# EAGLE design ATZB-RF-233-1-C-RPI-Breakout (EAGLE 7.7.0)
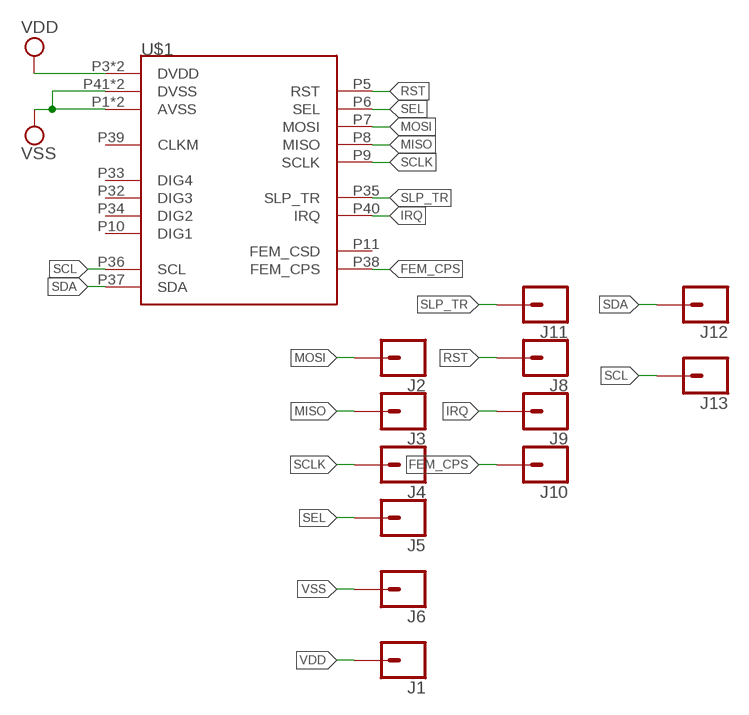
[diagram p0: schematic, sheet 1]

## Parts
J1  CONN_01OFFSET  [1X01_OFFSET]
J2  CONN_01OFFSET  [1X01_OFFSET]
J3  CONN_01OFFSET  [1X01_OFFSET]
J4  CONN_01OFFSET  [1X01_OFFSET]
J5  CONN_01OFFSET  [1X01_OFFSET]
J6  CONN_01OFFSET  [1X01_OFFSET]
J8  CONN_01OFFSET  [1X01_OFFSET]
J9  CONN_01OFFSET  [1X01_OFFSET]
J10  CONN_01OFFSET  [1X01_OFFSET]
J11  CONN_01OFFSET  [1X01_OFFSET]
J12  CONN_01OFFSET  [1X01_OFFSET]
J13  CONN_01OFFSET  [1X01_OFFSET]
U$1  ATZB-RF-233-1-C  [ATZB-RF-233-1-C]

## Nets
FEM_CPS: J10.1 U$1.P38(FEM_CPS)
IRQ: J9.1 U$1.P40(IRQ)
MISO: J3.1 U$1.P8(MISO)
MOSI: J2.1 U$1.P7(MOSI)
RST: J8.1 U$1.P5(RST)
SCL: J13.1 U$1.P36(SCL)
SCLK: J4.1 U$1.P9(SCLK)
SDA: J12.1 U$1.P37(SDA)
SEL: J5.1 U$1.P6(SEL)
SLP_TR: J11.1 U$1.P35(SLP_TR)
VDD: J1.1 U$1.P3(DVDD) U$1.P4(DVDD)
VSS: J6.1 U$1.P1(AVSS) U$1.P2(AVSS) U$1.P41(DVSS) U$1.P42(DVSS)
Unconnected: U$1.P10(DIG1) U$1.P11(FEM_CSD) U$1.P32(DIG3) U$1.P33(DIG4) U$1.P34(DIG2) U$1.P39(CLKM)

## Library data of the parts
J1-J6 J8-J13 = SparkFun-Connectors:CONN_01: Single connection point. Often used as Generic Header-pin footprint for 0.1 inch spaced/style header connections On any of the 0.1 inch spaced packages, you can populate with these: Break Away Headers - Straight <https://www.sparkfun.com/products/116> (PRT-00116) Break Away Male Headers - Right Angle <https://www.sparkfun.com/products/553> (PRT-00553) Female Headers <https://www.sparkfun.com/products/115> (PRT-00115) Break Away Headers - Machine Pin <https://www.sparkfun.com/products/117> (PRT-00117) Break Away Female Headers - Swiss Machine Pin <https://www.sparkfun.com/products/743> (PRT-00743) This device is also useful as a general connection point to wire up your design to another part of your project. Our various solder wires solder well into these plated through hole pads. Hook-Up Wire - Assortment (Stranded, 22 AWG) <https://www.sparkfun.com/products/11375> (PRT-11375) Hook-Up Wire - Assortment (Solid Core, 22 AWG) <https://www.sparkfun.com/products/11367> (PRT-11367) View the entire wire category on our website here <https://www.sparkfun.com/categories/141> Special notes: SMTSO-256-ET is a "flush mount" nut for a 4-40 screw. We mostly use this on specialty testbeds; it is a nice way to connect hardware to your PCB at an adjustable hieght. Also note, the SNAP packages are for using a snappable style connector. We sell a baggie of snaps and they are also used on two LilyPad designs: Snap Assortment - 30 pack (male and female) <https://www.sparkfun.com/products/11347> (DEV-11347) LilyPad Arduino SimpleSnap <https://www.sparkfun.com/products/10941> (DEV-10941) LilyPad SimpleSnap Protoboard <https://www.sparkfun.com/products/10940> (DEV-10940)
U$1 = radios:ATZB-RF-233-1-C

## Board
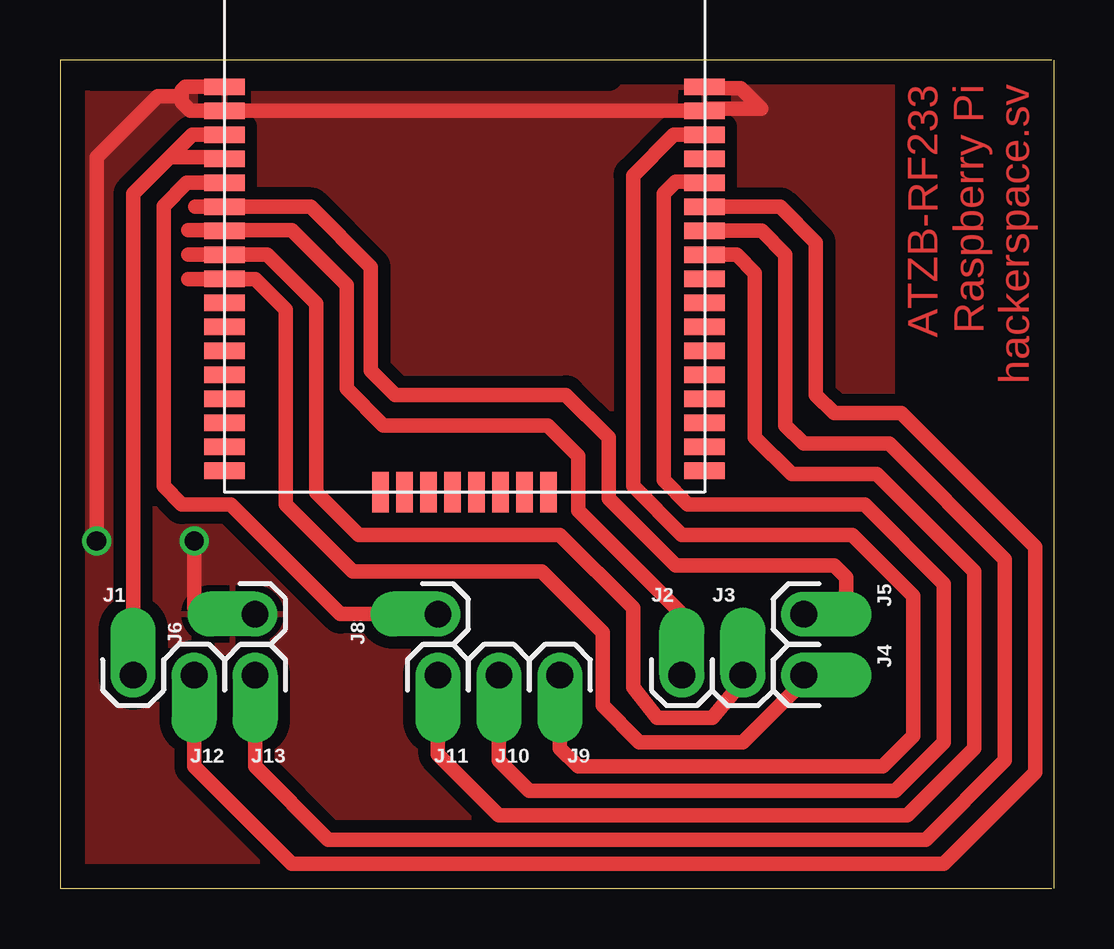
[diagram p1: board, top side]
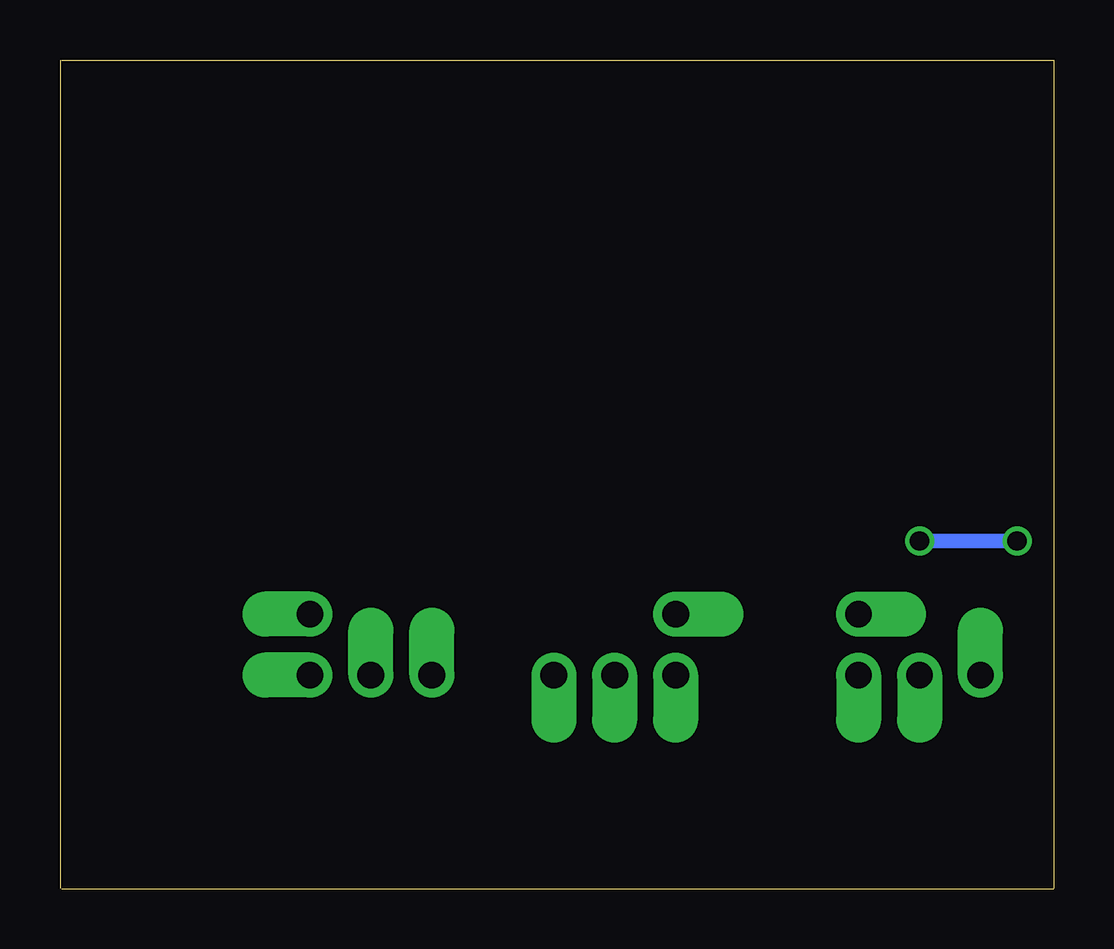
[diagram p2: board, bottom side, seen from below]

Size 41.4 x 34.54 mm. Coordinates in mm from the lower left corner, seen from the top.
Outline: 41.33,34.54 0,34.54 0,0.01
Outline: 41.4,34.54 41.4,0.01
Outline: 41.33,0 0,0
Copper layers (1*16): Top 0.035mm / dielectric 1.5mm / Bottom 0.035mm
Design rules "default": minimum track width 10mil, minimum drill 24mil, track to track 8mil, track to pad 8mil, pad to pad 8mil, via to via 8mil, smd to smd 8mil, copper to edge 40mil, drill to drill 8mil, minimum pad ring 10mil, minimum via ring 8mil, stop-mask expansion 4mil, vias tented up to drill 0mil, thermal gap 10mil

### Footprints (pad centres in the part's own frame; a part is rotated, then mirrored left to right if it is on the bottom)
1X01_OFFSET = drill 1.118 pad 1.88 offset: 1 0,0
ATZB-RF-233-1-C = smd 1.7 x 0.7: P1 0,16.9; P2 0,15.9; P3 0,14.9; P4 0,13.9; P5 0,12.9; P6 0,11.9; P7 0,10.9; P8 0,9.9; P9 0,8.9; P10 0,7.9; P11 0,6.9; P12 0,5.9; P13 0,4.9; P14 0,3.9; P15 0,2.9; P16 0,1.9; P17 0,0.9; P26 20,0.9; P27 20,1.9; P28 20,2.9; P29 20,3.9; P30 20,4.9; P31 20,5.9; P32 20,6.9; P33 20,7.9; P34 20,8.9; P35 20,9.9; P36 20,10.9; P37 20,11.9; P38 20,12.9; P39 20,13.9; P40 20,14.9; P41 20,15.9; P42 20,16.9 | smd 0.7 x 1.7: P18 6.5,0; P19 7.5,0; P20 8.5,0; P21 9.5,0; P22 10.5,0; P23 11.5,0; P24 12.5,0; P25 13.5,0

### Placement (x,y rotation side)
J1  3.05,8.9 0 top
J2  25.91,8.9 0 top
J3  28.45,8.9 0 top
J4  30.99,8.9 270 top
J5  30.99,11.44 270 top
J6  8.13,11.44 90 top
J8  15.75,11.44 90 top
J9  20.83,8.9 180 top
J10  18.29,8.9 180 top
J11  15.75,8.9 180 top
J12  5.59,8.9 180 top
J13  8.13,8.9 180 top
U$1  6.86,16.52 0 top

### Tracks (layer width: path | path; a pad name or v marks a point on that pad's centre or on a via)
FEM_CPS
  Top 0.61: 26.11,29.42 U$1.P38 26.8,29.47 25.65,29.47 25.15,28.97 25.15,17.03 26.16,16.01 33.53,16.01 36.83,12.71 36.83,6.11 34.8,4.07 19.56,4.07 18.29,5.34 J10.1
IRQ
  Top 0.61: U$1.P40 25.57,31.42 23.88,29.73 23.88,16.77 25.91,14.74 33.02,14.74 35.56,12.2 35.56,6.36 34.29,5.09 21.59,5.09 20.83,5.85 J9.1
MISO
  Top 0.61: U$1.P8 U$1.P8 arc-90 U$1.P8 | U$1.P8 5.33,26.43 | U$1.P8 8.64,26.43 10.67,24.39 10.67,16.52 12.45,14.74 20.83,14.74 23.88,11.69 23.88,8.39 24.89,7.12 27.18,7.12 28.45,8.65 J3.1
MOSI
  Top 0.406: 6.84,27.44 U$1.P7
  Top 0.61: J2.1 25.91,11.44 21.59,15.76 21.59,18.04 20.32,19.31 13.46,19.31 11.94,20.84 11.94,25.16 9.65,27.44 6.88,27.44 | 6.88,27.44 U$1.P7 arc-90 6.88,27.44 | 6.88,27.44 5.33,27.44
RST
  Top 0.61: U$1.P5 5.28,29.42 4.32,28.46 4.32,16.77 5.08,16.01 7.11,16.01 11.68,11.44 J8.1
SCL
  Top 0.61: U$1.P36 29.23,27.42 30.23,26.43 30.23,19.31 30.99,18.55 34.54,18.55 39.37,13.73 39.37,5.34 36.07,2.04 11.18,2.04 8.13,5.09 J13.1
SCLK
  Top 0.61: J4.1 30.99,8.65 28.45,6.11 24.13,6.11 22.61,7.63 22.61,10.68 20.07,13.22 12.19,13.22 9.4,16.01 9.4,24.14 8.13,25.41 U$1.P9 | U$1.P9 U$1.P9 arc90 U$1.P9 | U$1.P9 5.33,25.41
SDA
  Top 0.61: U$1.P37 30.01,28.42 31.5,26.93 31.5,20.58 32.26,19.82 35.05,19.82 40.64,14.23 40.64,4.84 36.83,1.03 9.65,1.03 5.59,5.09 J12.1
SEL
  Top 0.61: U$1.P6 6.82,28.46 | J5.1 32.77,11.44 32.77,12.96 32.26,13.47 25.65,13.47 22.86,16.27 22.86,18.81 21.08,20.58 13.97,20.58 12.95,21.6 12.95,25.92 10.45,28.42 U$1.P6 | U$1.P6 5.63,28.42
SLP_TR
  Top 0.61: U$1.P35 28.2,26.42 28.96,25.66 28.96,18.81 30.48,17.28 34.04,17.28 38.1,13.22 38.1,5.85 35.31,3.06 18.29,3.06 15.75,5.6 J11.1
VDD
  Top 0.61: J1.1 3.05,28.97 4.57,30.49 | 4.57,30.49 6.79,30.49 U$1.P4 | U$1.P3 5.5,31.42 4.57,30.49
VSS  (via drill 0.8)
  Top 0.61: 7.13,33.42 U$1.P1 5.22,33.42 5.08,33.28 5.08,33.03 | U$1.P42 26.86,33.37 28.36,33.37 29.21,32.52 26.96,32.52 U$1.P41 U$1.P2 5.44,32.42 5.08,32.78 5.08,33.03 | v1.52,14.49 1.52,30.49 4.06,33.03 5.08,33.03 | v5.59,14.49 5.59,11.69 5.84,11.44 J6.1
  Bottom 0.61: v5.59,14.49 v1.52,14.49
  pour Top (isolate 0.508): 0,0.01 41.4,0.01 41.4,34.55 0,34.55

### Text on the board
Top: ATZB-RF233 / Raspberry Pi / hackerspace.sv